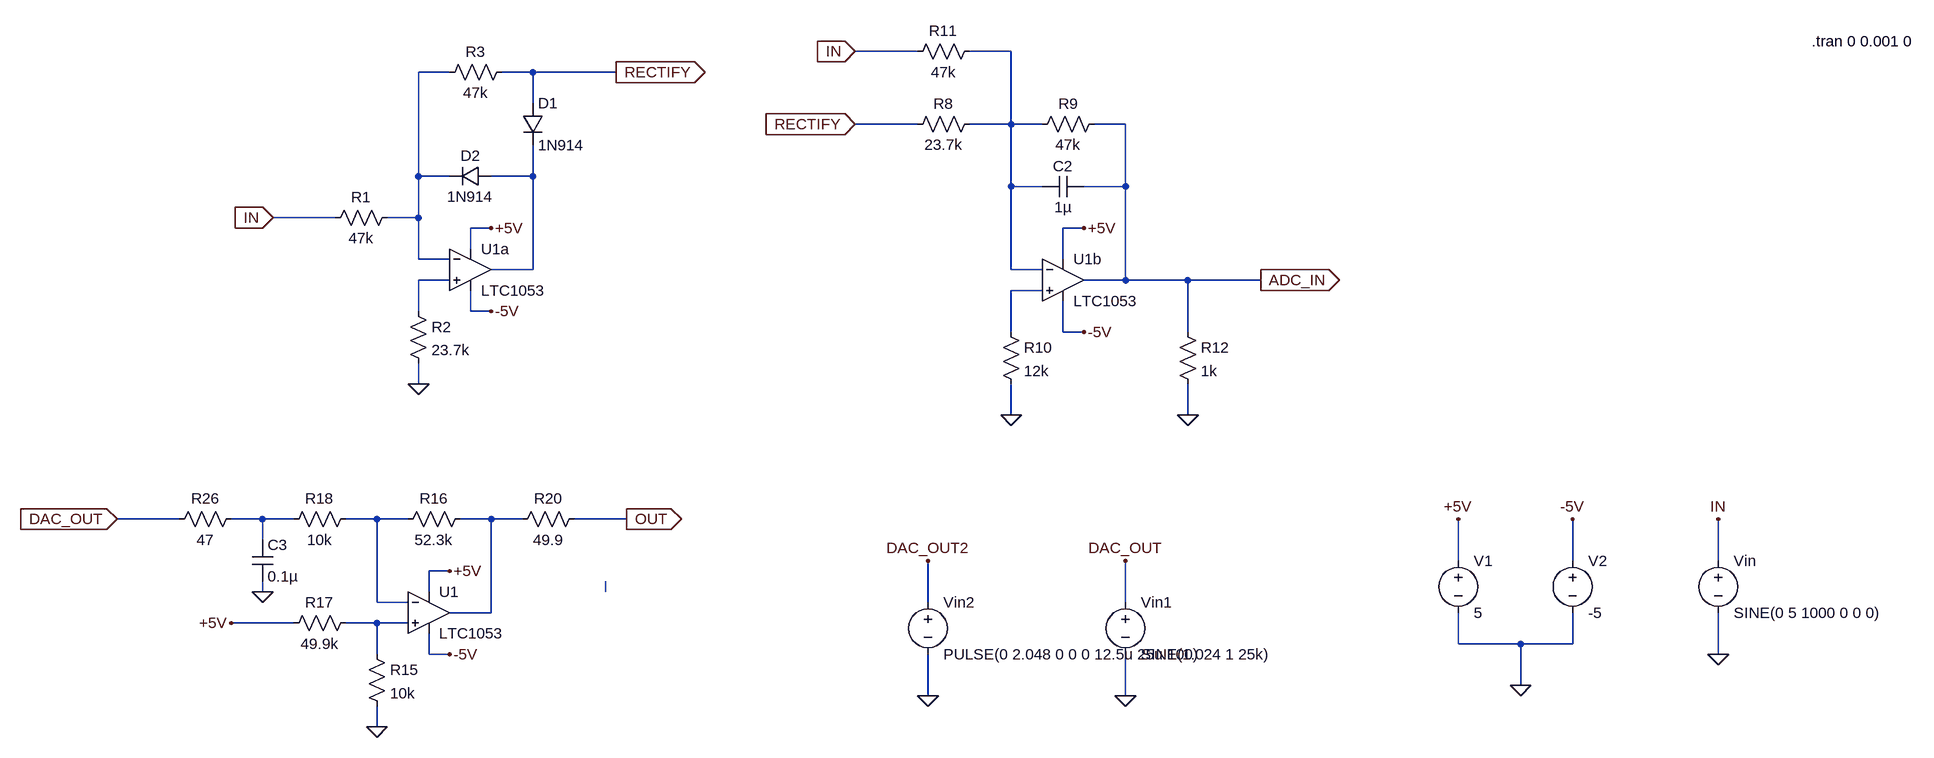
[diagram p0: schematic Function_Gen.asc]
Function_Gen.asc, the LTspice schematic file:
Version 4
SHEET 1 2136 788
WIRE -192 -336 -288 -336
WIRE -48 -336 -112 -336
WIRE -912 -304 -960 -304
WIRE -784 -304 -832 -304
WIRE -656 -304 -784 -304
WIRE -784 -256 -784 -304
WIRE -192 -224 -288 -224
WIRE -48 -224 -48 -336
WIRE -48 -224 -112 -224
WIRE 0 -224 -48 -224
WIRE 128 -224 80 -224
WIRE -960 -144 -960 -304
WIRE -912 -144 -960 -144
WIRE -784 -144 -784 -192
WIRE -784 -144 -848 -144
WIRE -48 -128 -48 -224
WIRE 0 -128 -48 -128
WIRE 128 -128 128 -224
WIRE 128 -128 64 -128
WIRE -1088 -80 -1184 -80
WIRE -960 -80 -960 -144
WIRE -960 -80 -1008 -80
WIRE -848 -64 -880 -64
WIRE 64 -64 32 -64
WIRE -880 -32 -880 -64
WIRE -960 -16 -960 -80
WIRE -912 -16 -960 -16
WIRE 32 -16 32 -64
WIRE -784 0 -784 -144
WIRE -784 0 -848 0
WIRE -48 0 -48 -128
WIRE 0 0 -48 0
WIRE -912 16 -960 16
WIRE 128 16 128 -128
WIRE 128 16 64 16
WIRE 224 16 128 16
WIRE 336 16 224 16
WIRE 0 32 -48 32
WIRE -960 64 -960 16
WIRE -880 64 -880 32
WIRE -848 64 -880 64
WIRE -48 96 -48 32
WIRE 32 96 32 48
WIRE 64 96 32 96
WIRE 224 96 224 16
WIRE -960 176 -960 144
WIRE -48 224 -48 176
WIRE 224 224 224 176
WIRE -1328 384 -1424 384
WIRE -1200 384 -1248 384
WIRE -1152 384 -1200 384
WIRE -1024 384 -1072 384
WIRE -976 384 -1024 384
WIRE -848 384 -896 384
WIRE -800 384 -848 384
WIRE -640 384 -720 384
WIRE -1200 416 -1200 384
WIRE 640 448 640 384
WIRE 816 448 816 384
WIRE 1040 448 1040 384
WIRE -912 464 -944 464
WIRE -1200 496 -1200 480
WIRE -944 496 -944 464
WIRE -672 496 -672 480
WIRE -1024 512 -1024 384
WIRE -976 512 -1024 512
WIRE -176 512 -176 448
WIRE 128 512 128 448
WIRE -848 528 -848 384
WIRE -848 528 -912 528
WIRE -1152 544 -1248 544
WIRE -1024 544 -1072 544
WIRE -976 544 -1024 544
WIRE 640 576 640 528
WIRE 736 576 640 576
WIRE 816 576 816 528
WIRE 816 576 736 576
WIRE -1024 592 -1024 544
WIRE -944 592 -944 560
WIRE -912 592 -944 592
WIRE 1040 592 1040 528
WIRE 736 640 736 576
WIRE -176 656 -176 592
WIRE 128 656 128 592
WIRE -1024 704 -1024 672
FLAG -1184 -80 IN
IOPIN -1184 -80 In
FLAG -960 176 0
FLAG -848 -64 +5V
FLAG -848 64 -5V
FLAG 640 384 +5V
FLAG 816 384 -5V
FLAG 736 640 0
FLAG 1040 592 0
FLAG 1040 384 IN
FLAG 336 16 ADC_IN
IOPIN 336 16 Out
FLAG 64 -64 +5V
FLAG 64 96 -5V
FLAG -48 224 0
FLAG -288 -336 IN
IOPIN -288 -336 In
FLAG -288 -224 RECTIFY
IOPIN -288 -224 In
FLAG -656 -304 RECTIFY
IOPIN -656 -304 Out
FLAG 224 224 0
FLAG -1024 704 0
FLAG -912 464 +5V
FLAG -912 592 -5V
FLAG -640 384 OUT
IOPIN -640 384 Out
FLAG 128 656 0
FLAG 128 448 DAC_OUT
FLAG -1248 544 +5V
FLAG -1424 384 DAC_OUT
IOPIN -1424 384 In
FLAG -1200 496 0
FLAG -176 656 0
FLAG -176 448 DAC_OUT2
SYMBOL res -992 -96 R90
WINDOW 0 0 56 VBottom 2
WINDOW 3 32 56 VTop 2
SYMATTR InstName R1
SYMATTR Value 47k
SYMBOL res -976 48 R0
SYMATTR InstName R2
SYMATTR Value 23.7k
SYMBOL diode -848 -160 R90
WINDOW 0 0 32 VBottom 2
WINDOW 3 32 32 VTop 2
SYMATTR InstName D2
SYMATTR Value 1N914
SYMBOL diode -800 -256 R0
SYMATTR InstName D1
SYMATTR Value 1N914
SYMBOL res -816 -320 R90
WINDOW 0 0 56 VBottom 2
WINDOW 3 32 56 VTop 2
SYMATTR InstName R3
SYMATTR Value 47k
SYMBOL voltage 640 432 R0
WINDOW 123 0 0 Left 2
WINDOW 39 0 0 Left 2
SYMATTR InstName V1
SYMATTR Value 5
SYMBOL voltage 816 432 R0
WINDOW 123 0 0 Left 2
WINDOW 39 0 0 Left 2
SYMATTR InstName V2
SYMATTR Value -5
SYMBOL voltage 1040 432 R0
WINDOW 39 24 117 Left 2
SYMATTR InstName Vin
SYMATTR Value SINE(0 5 1000 0 0 0)
SYMATTR Value2 AC 0 0
SYMBOL LTC1053 -880 -64 R0
SYMATTR InstName U1a
SYMBOL cap 64 -144 R90
WINDOW 0 0 32 VBottom 2
WINDOW 3 32 32 VTop 2
SYMATTR InstName C2
SYMATTR Value 1µ
SYMBOL res -96 -240 R90
WINDOW 0 0 56 VBottom 2
WINDOW 3 32 56 VTop 2
SYMATTR InstName R8
SYMATTR Value 23.7k
SYMBOL res 96 -240 R90
WINDOW 0 0 56 VBottom 2
WINDOW 3 32 56 VTop 2
SYMATTR InstName R9
SYMATTR Value 47k
SYMBOL res -64 80 R0
SYMATTR InstName R10
SYMATTR Value 12k
SYMBOL LTC1053 32 -48 R0
SYMATTR InstName U1b
SYMBOL res -96 -352 R90
WINDOW 0 0 56 VBottom 2
WINDOW 3 32 56 VTop 2
SYMATTR InstName R11
SYMATTR Value 47k
SYMBOL res 208 80 R0
SYMATTR InstName R12
SYMATTR Value 1k
SYMBOL res -1040 576 R0
SYMATTR InstName R15
SYMATTR Value 10k
SYMBOL res -880 368 R90
WINDOW 0 0 56 VBottom 2
WINDOW 3 32 56 VTop 2
SYMATTR InstName R16
SYMATTR Value 52.3k
SYMBOL LTC1053 -944 464 R0
SYMATTR InstName U1
SYMBOL res -1056 528 R90
WINDOW 0 0 56 VBottom 2
WINDOW 3 32 56 VTop 2
SYMATTR InstName R17
SYMATTR Value 49.9k
SYMBOL voltage 128 496 R0
WINDOW 39 24 117 Left 2
SYMATTR InstName Vin1
SYMATTR Value SINE(1.024 1 25k)
SYMATTR Value2 AC 0 0
SYMBOL res -1056 368 R90
WINDOW 0 0 56 VBottom 2
WINDOW 3 32 56 VTop 2
SYMATTR InstName R18
SYMATTR Value 10k
SYMBOL res -1232 368 R90
WINDOW 0 0 56 VBottom 2
WINDOW 3 32 56 VTop 2
SYMATTR InstName R26
SYMATTR Value 47
SYMBOL cap -1216 416 R0
SYMATTR InstName C3
SYMATTR Value 0.1µ
SYMBOL voltage -176 496 R0
WINDOW 39 24 117 Left 2
SYMATTR InstName Vin2
SYMATTR Value PULSE(0 2.048 0 0 0 12.5u 25u 100)
SYMATTR Value2 AC 0 0
SYMBOL res -704 368 R90
WINDOW 0 0 56 VBottom 2
WINDOW 3 32 56 VTop 2
SYMATTR InstName R20
SYMATTR Value 49.9
TEXT 1184 -352 Left 2 !.tran 0 0.001 0

The netlist it stands for:
* Function_Gen.asc
R1 N002 IN 47k
R2 N004 0 23.7k
D2 N003 N002 1N914
D1 RECTIFY N003 1N914
R3 RECTIFY N002 47k
V1 +5V 0 5
V2 -5V 0 -5
Vin IN 0 SINE(0 5 1000 0 0 0) AC 0 0
* U1a: LTC1053 (symbol LTC1053 not available, pins judged from their places): In+=N004 In-=N002 V+=+5V V-=-5V OUT=N003
C2 ADC_IN N001 1µ
R8 N001 RECTIFY 23.7k
R9 ADC_IN N001 47k
R10 N005 0 12k
* U1b: LTC1053 (symbol LTC1053 not available, pins judged from their places): In+=N005 In-=N001 V+=+5V V-=-5V OUT=ADC_IN
R11 N001 IN 47k
R12 ADC_IN 0 1k
R15 N010 0 10k
R16 N008 N007 52.3k
* U1: LTC1053 (symbol LTC1053 not available, pins judged from their places): In+=N010 In-=N007 V+=+5V V-=-5V OUT=N008
R17 N010 +5V 49.9k
Vin1 DAC_OUT 0 SINE(1.024 1 25k) AC 0 0
R18 N007 N006 10k
R26 N006 DAC_OUT 47
C3 N006 0 0.1µ
Vin2 DAC_OUT2 0 PULSE(0 2.048 0 0 0 12.5u 25u 100) AC 0 0
R20 OUT N008 49.9
.model D D
.lib standard.dio
.tran 0 0.001 0
.backanno
.end